# Altium schematic sheet motor_channel_x2.SchDoc
size A3; DocumentNumber: 2; SheetNumber: 2; SheetTotal: 6
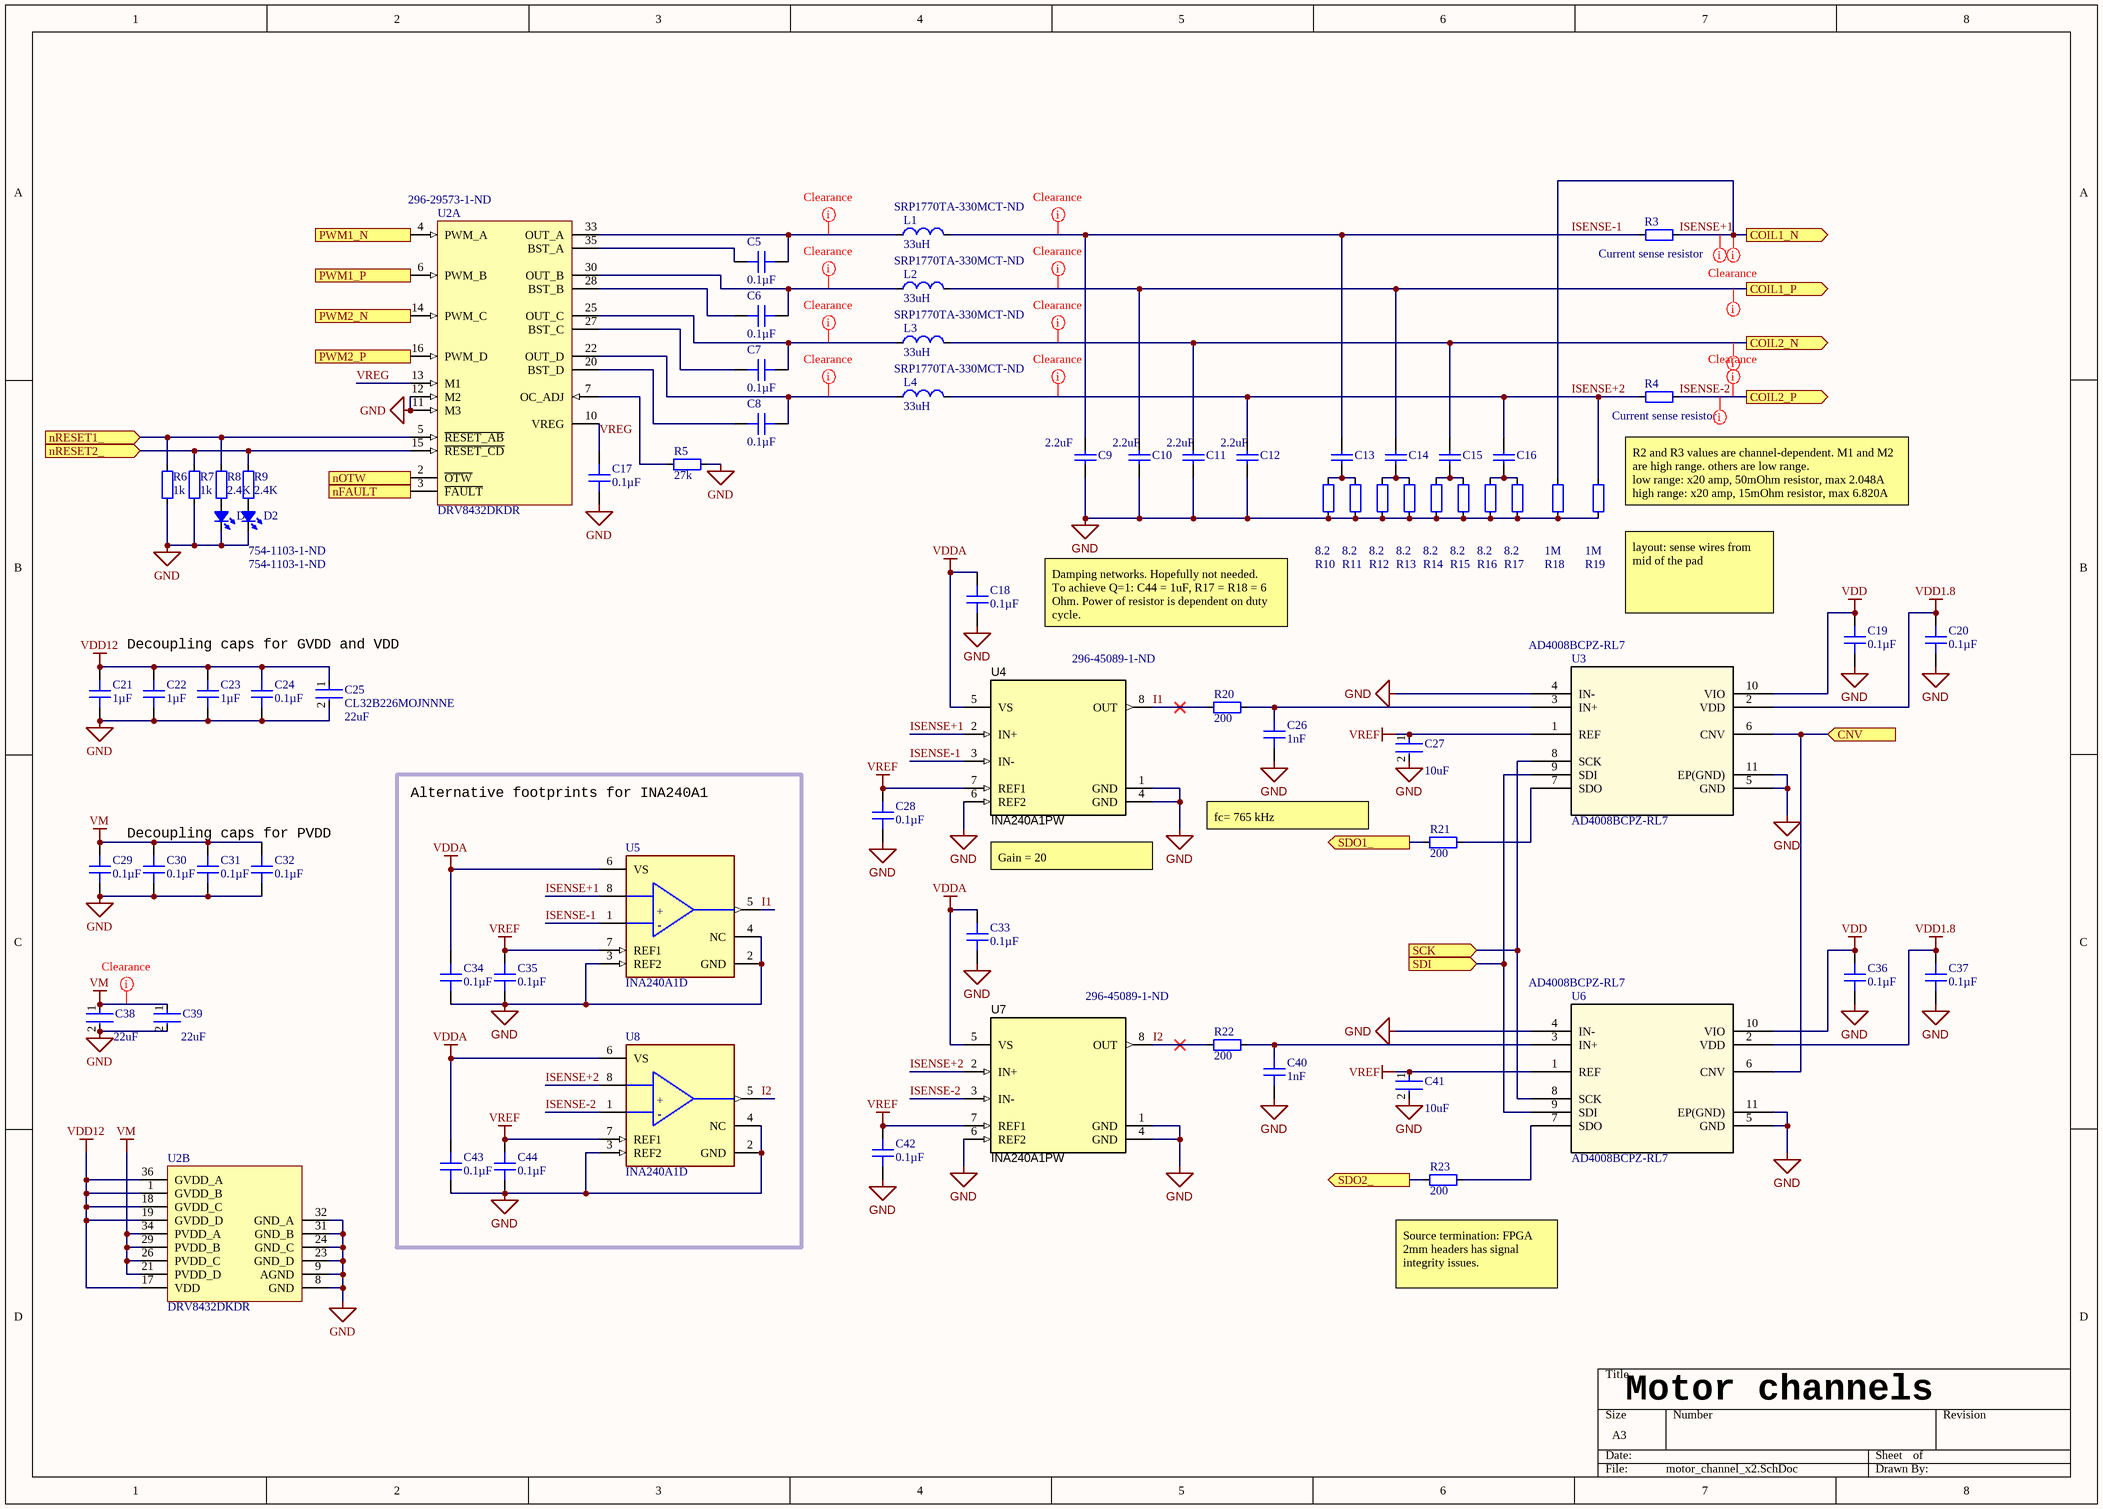
[diagram p0: motor_channel_x2.SchDoc]

## Parts
C5  0.1µF  [FP-GRM188-0_1-e0_2_0_55-IPC_B]
C6  0.1µF  [FP-GRM188-0_1-e0_2_0_55-IPC_B]
C7  0.1µF  [FP-GRM188-0_1-e0_2_0_55-IPC_B]
C8  0.1µF  [FP-GRM188-0_1-e0_2_0_55-IPC_B]
C9  Capacitance: 2.2uF  [CAPC3216X180X50NL20T25]  (hidden comment: 12061C225KAT2A)
C10  Capacitance: 2.2uF  [CAPC3216X180X50NL20T25]  (hidden comment: 12061C225KAT2A)
C11  Capacitance: 2.2uF  [CAPC3216X180X50NL20T25]  (hidden comment: 12061C225KAT2A)
C12  Capacitance: 2.2uF  [CAPC3216X180X50NL20T25]  (hidden comment: 12061C225KAT2A)
C13  12061C105KAT2A  [CAPC3216X180X50NL20T25]  (value not drawn)
C14  12061C105KAT2A  [CAPC3216X180X50NL20T25]  (value not drawn)
C15  12061C105KAT2A  [CAPC3216X180X50NL20T25]  (value not drawn)
C16  12061C105KAT2A  [CAPC3216X180X50NL20T25]  (value not drawn)
C17  0.1µF  [FP-GRM155-0_05-IPC_B]
C18  0.1µF  [FP-GRM155-0_05-IPC_B]
C19  0.1µF  [FP-GRM155-0_05-IPC_B]
C20  0.1µF  [FP-GRM155-0_05-IPC_B]
C21  1µF  [FP-GRM188-0_1-e0_2_0_55-IPC_B]
C22  1µF  [FP-GRM188-0_1-e0_2_0_55-IPC_B]
C23  1µF  [FP-GRM188-0_1-e0_2_0_55-IPC_B]
C24  0.1µF  [FP-GRM155-0_05-IPC_B]
C25  CL32B226MOJNNNE  Capacitance: 22uF  [FP-CL32-IPC_B]
C26  1nF  [FP-GRM155-0_05-IPC_B]
C27  Capacitance: 10uF  [FP-CL21-IPC_C]  (hidden comment: CL21B106KQQNNNG)
C28  0.1µF  [FP-GRM155-0_05-IPC_B]
C29  0.1µF  [FP-GRM188-0_1-e0_2_0_55-IPC_B]
C30  0.1µF  [FP-GRM188-0_1-e0_2_0_55-IPC_B]
C31  0.1µF  [FP-GRM188-0_1-e0_2_0_55-IPC_B]
C32  0.1µF  [FP-GRM188-0_1-e0_2_0_55-IPC_B]
C33  0.1µF  [FP-GRM155-0_05-IPC_B]
C34  0.1µF  [FP-GRM155-0_05-IPC_B]
C35  0.1µF  [FP-GRM155-0_05-IPC_B]
C36  0.1µF  [FP-GRM155-0_05-IPC_B]
C37  0.1µF  [FP-GRM155-0_05-IPC_B]
C38  Capacitance: 22uF  [FP-KRM55W-6_1_5_3_6_7_1_2-MFG]  (hidden comment: KRM55WR72A226MH01L)
C39  Capacitance: 22uF  [FP-KRM55W-6_1_5_3_6_7_1_2-MFG]  (hidden comment: KRM55WR72A226MH01L)
C40  1nF  [FP-GRM155-0_05-IPC_B]
C41  Capacitance: 10uF  [FP-CL21-IPC_C]  (hidden comment: CL21B106KQQNNNG)
C42  0.1µF  [FP-GRM155-0_05-IPC_B]
C43  0.1µF  [FP-GRM155-0_05-IPC_B]
C44  0.1µF  [FP-GRM155-0_05-IPC_B]
D1  Supplier Part Number 1: 754-1103-1-ND  [ROHM-SML-P11MT_V]  (hidden comment: LED_0402)
D2  Supplier Part Number 1: 754-1103-1-ND  [ROHM-SML-P11MT_V]  (hidden comment: LED_0402)
L1  value 33uH  Supplier Part Number 1: SRP1770TA-330MCT-ND  [SRP1770TA]
L2  value 33uH  Supplier Part Number 1: SRP1770TA-330MCT-ND  [SRP1770TA]
L3  value 33uH  Supplier Part Number 1: SRP1770TA-330MCT-ND  [SRP1770TA]
L4  value 33uH  Supplier Part Number 1: SRP1770TA-330MCT-ND  [SRP1770TA]
R3  Current sense resistor  [STACKPOLE CSR2512]
R4  Current sense resistor  [STACKPOLE CSR2512]
R5  value 27k  [FP-CRCW0402-e3-IPC_B]  (hidden comment: Res_0402)
R6  value 1k  [FP-CRCW0805-HPe3-IPC_B]  (hidden comment: Res_0805)
R7  value 1k  [FP-CRCW0805-HPe3-IPC_B]  (hidden comment: Res_0805)
R8  value 2.4K  [FP-CRCW0402-e3-IPC_B]  (hidden comment: Res_0402)
R9  value 2.4K  [FP-CRCW0402-e3-IPC_B]  (hidden comment: Res_0402)
R10  value 8.2  [RESC3216X70X50NL05T20]  (hidden comment: Res_0402)
R11  value 8.2  [RESC3216X70X50NL05T20]  (hidden comment: Res_0402)
R12  value 8.2  [RESC3216X70X50NL05T20]  (hidden comment: Res_0402)
R13  value 8.2  [RESC3216X70X50NL05T20]  (hidden comment: Res_0402)
R14  value 8.2  [RESC3216X70X50NL05T20]  (hidden comment: Res_0402)
R15  value 8.2  [RESC3216X70X50NL05T20]  (hidden comment: Res_0402)
R16  value 8.2  [RESC3216X70X50NL05T20]  (hidden comment: Res_0402)
R17  value 8.2  [RESC3216X70X50NL05T20]  (hidden comment: Res_0402)
R18  value 1M  [FP-CRCW0402-e3-IPC_B]  (hidden comment: Res_0402)
R19  value 1M  [FP-CRCW0402-e3-IPC_B]  (hidden comment: Res_0402)
R20  value 200  [FP-CRCW0402-e3-IPC_B]  (hidden comment: Res_0402)
R21  value 200  [FP-CRCW0402-e3-IPC_B]  (hidden comment: Res_0402)
R22  value 200  [FP-CRCW0402-e3-IPC_B]  (hidden comment: Res_0402)
R23  value 200  [FP-CRCW0402-e3-IPC_B]  (hidden comment: Res_0402)
U2  DRV8432DKDR  Supplier Part Number 1: 296-29573-1-ND  [DKD0036A_L_extra_clearance]  (parts A,B of 2)
U3  AD4008BCPZ-RL7  [CP_10_9]
U4  INA240A1PW  Supplier Part Number 1: 296-45089-1-ND  [PW0008A_N]
U5  INA240A1D  [FP-D0008A-IPC_C]
U6  AD4008BCPZ-RL7  [CP_10_9]
U7  INA240A1PW  Supplier Part Number 1: 296-45089-1-ND  [PW0008A_N]
U8  INA240A1D  [FP-D0008A-IPC_C]

## Blocks framed on the sheet
Alternative footprints for INA240A1: C34 C35 C43 C44 U5 U8

## Ports
CNV (in), COIL1_N (out), COIL1_P (out), COIL2_N (out), COIL2_P (out), nFAULT (out), nOTW (out), nRESET1_ (in), nRESET2_ (in), PWM1_N (in), PWM1_P (in), PWM2_N (in), PWM2_P (in), SCK (in), SDI (in), SDO1_ (out), SDO2_ (out)

## Nets
GND: C9.1 C10.1 C11.1 C12.1 C17.2 C18.2 C19.2 C20.2 C21.2 C22.2 C23.2 C24.2 C25.2 C26.2 C27.2 C28.2 C29.2 C30.2 C31.2 C32.2 C33.2 C34.2 C35.2 C36.2 C37.2 C38.2 C39.2 C40.2 C41.2 C42.2 C43.2 C44.2 D1.2(K) D2.2(K) R5.2 R6.1 R7.1 R10.1 R11.1 R12.1 R13.1 R14.1 R15.1 R16.1 R17.1 R18.1 R19.1 U2.8(GND) U2.9(AGND) U2.11(M3) U2.12(M2) U2.23(GND_D) U2.24(GND_C) U2.31(GND_B) U2.32(GND_A) U3.4(IN-) U3.5(GND) U3.11(EP(GND)) U4.1(GND) U4.4(GND) U4.6(REF2) U5.2(GND) U5.3(REF2) U5.4(NC) U6.4(IN-) U6.5(GND) U6.11(EP(GND)) U7.1(GND) U7.4(GND) U7.6(REF2) U8.2(GND) U8.3(REF2) U8.4(NC)
VDD: C19.1 C36.1 U3.10(VIO) U6.10(VIO)
VDD1.8: C20.1 C37.1 U3.2(VDD) U6.2(VDD)
VDD12: C21.1 C22.1 C23.1 C24.1 C25.1 U2.1(GVDD_B) U2.17(VDD) U2.18(GVDD_C) U2.19(GVDD_D) U2.36(GVDD_A)
VDDA: C18.1 C33.1 C34.1 C43.1 U4.5(VS) U5.6(VS) U7.5(VS) U8.6(VS)
VM: C29.1 C30.1 C31.1 C32.1 C38.1 C39.1 U2.21(PVDD_D) U2.26(PVDD_C) U2.29(PVDD_B) U2.34(PVDD_A)
VREF: C27.1 C28.1 C35.1 C41.1 C42.1 C44.1 U3.1(REF) U4.7(REF1) U5.7(REF1) U6.1(REF) U7.7(REF1) U8.7(REF1)
CNV: U3.6(CNV) U6.6(CNV) ; port CNV
COIL1_P: C10.2 C14.1 L2.2 ; port COIL1_P
COIL2_N: C11.2 C15.1 L3.2 ; port COIL2_N
I1: R20.1 U4.8(OUT) U5.5(OUT)
I2: R22.1 U7.8(OUT) U8.5(OUT)
ISENSE+1: R3.2 R18.2 U4.2(IN+) U5.8(IN+) ; port COIL1_N
ISENSE+2: C12.2 C16.1 L4.2 R4.1 R19.2 U7.2(IN+) U8.8(IN+)
ISENSE-1: C9.2 C13.1 L1.2 R3.1 U4.3(IN-) U5.1(IN-)
ISENSE-2: R4.2 U7.3(IN-) U8.1(IN-) ; port COIL2_P
nFAULT: U2.3(~{FAULT}) ; port nFAULT
nOTW: U2.2(~{OTW}) ; port nOTW
nRESET1_: R6.2 R8.2 U2.5(~{RESET_AB}) ; port nRESET1_
nRESET2_: R7.2 R9.2 U2.15(~{RESET_CD}) ; port nRESET2_
PWM1_N: U2.4(PWM_A) ; port PWM1_N
PWM1_P: U2.6(PWM_B) ; port PWM1_P
PWM2_N: U2.14(PWM_C) ; port PWM2_N
PWM2_P: U2.16(PWM_D) ; port PWM2_P
SCK: U3.8(SCK) U6.8(SCK) ; port SCK
SDI: U3.9(SDI) U6.9(SDI) ; port SDI
SDO1_: R21.1 ; port SDO1_
SDO2_: R23.1 ; port SDO2_
VREG: C17.1 U2.10(VREG) U2.13(M1)
NetC5_1: C5.1 U2.35(BST_A)
NetC5_2: C5.2 L1.1 U2.33(OUT_A)
NetC6_1: C6.1 U2.28(BST_B)
NetC6_2: C6.2 L2.1 U2.30(OUT_B)
NetC7_1: C7.1 U2.27(BST_C)
NetC7_2: C7.2 L3.1 U2.25(OUT_C)
NetC8_1: C8.1 U2.20(BST_D)
NetC8_2: C8.2 L4.1 U2.22(OUT_D)
NetC13_2: C13.2 R10.2 R11.2
NetC14_2: C14.2 R12.2 R13.2
NetC15_2: C15.2 R14.2 R15.2
NetC16_2: C16.2 R16.2 R17.2
NetC26_1: C26.1 R20.2 U3.3(IN+)
NetC40_1: C40.1 R22.2 U6.3(IN+)
NetD1_1: D1.1(A) R8.1
NetD2_1: D2.1(A) R9.1
NetR5_1: R5.1 U2.7(OC_ADJ)
NetR21_2: R21.2 U3.7(SDO)
NetR23_2: R23.2 U6.7(SDO)

## Layout directives
net class hv: COIL1_P, COIL2_N, ISENSE+1, ISENSE+2, ISENSE-1, ISENSE-2, NetC5_2, NetC6_2, NetC7_2, NetC8_2, VM
net class no-copy-routing: COIL1_P, COIL2_N, ISENSE+1, ISENSE-2

## Notes on the sheet
- R2 and R3 values are channel-dependent. M1 and M2 are high range. others are low range.
  low range: x20 amp, 50mOhm resistor, max 2.048A
  high range: x20 amp, 15mOhm resistor, max 6.820A
- Decoupling caps for GVDD and VDD
- Damping networks. Hopefully not needed.
  To achieve Q=1: C44 = 1uF, R17 = R18 = 6 Ohm. Power of resistor is dependent on duty cycle.
- (near R19) layout: sense wires from mid of the pad
- Decoupling caps for PVDD
- fc= 765 kHz
- Gain = 20
- (near R23) Source termination: FPGA 2mm headers has signal integrity issues.
- Motor channels
- (in symbol CMP-04895-000409-1) +; -

## Library data of the parts
C5-C8 C29-C32 = 06031C104KAT2A: CAP CER 0.1UF 100V X7R 0603; Manufacturer: AVX Corporation; Tolerance: ±10%; Part Number: 06031C104KAT2A; Value: 0.1µF; Applications: General Purpose; Capacitance: 0.1µF; ComponentLink1Description: Datasheet; ComponentLink1URL: http://datasheets.avx.com/X7RDielectric.pdf; ComponentLink2Description: DigiKey Link; ComponentLink2URL: http://digikey.com/product-detail/en/avx-corporation/06031C104KAT2A/478-10047-1-ND/6564270; Device Package: 0603 (1608 Metric); LastUpdated: 9/2/2020 1:03:14 AM; Lifecycle Status: Active; Minimum Order: 1; Mounting Type: Surface Mount, MLCC; Operating Temperature: -55°C ~ 125°C; Package / Case: 0603 (1608 Metric); Packaging: TapeAndReel; PartId: 14077; Part Status: Active; Price: 0.03; Series: -; Size / Dimension: 0.063" L x 0.032" W (1.60mm x 0.81mm); Supplier 1: DigiKey; Supplier Part Number 1: 478-10047-1-ND; Temperature Coefficient: X7R; Thickness (Max): 0.037" (0.94mm); Voltage - Rated: 100V
C9-C12 = CMP-2000-07542-1: Chip Capacitor, 2.2 uF, +/- 10%, 100 V, -55 to 125 degC, 1206 (3216 Metric), RoHS, Tape and Reel; Manufacturer: AVX; Case\/Package: 1206; Voltage: 100V; Dielectric: X7R; Thickness: 0.037inch; Case Code (Metric): 3216; Mounting Technology: SurfaceMount; Tolerance: 10%; Package Quantity: 2500; Mount: SurfaceMount; REACH SVHC: NoSVHC; Case Code (Imperial): 1206; Datasheet URL: http://datasheets.avx.com/X7RDielectric.pdf; Voltage Rating: 100V; Package Reference: 1206; Termination: SMD/SMT; Max Operating Temperature: 125degC; Depth: 1.6mm; Voltage Rating (DC): 100V; Width: 0.063inch; Min Operating Temperature: -55degC; RoHSCompliant: true; Packaging: TapeandReel; Package Description: 2-Pin Surface Mount Device, Body 3.2 x 1.6 mm; Datasheet Version: 03/2017; Manufacturer URL: http://www.avx.com/; Lead Free: LeadFree; Length: 3.2mm
C13-C16 = CMP-1037-04728-2: Chip Capacitor, 1 uF, +/- 10%, 100 V, -55 to 125 degC, 1206 (3216 Metric), RoHS, Tape and Reel; Manufacturer: AVX; Capacitance: 1µF; Dielectric: X7R; Rated Voltage: 100V; Mounting Technology: SurfaceMount; Package Description: 2-Pin Surface Mount Device, Body 3.2 x 1.6 mm; Case Size/Dimension: 1206; Datasheet Version: 07/2016; Manufacturer URL: http://www.avx.com/; Package Reference: 1206; Datasheet URL: http://datasheets.avx.com/X7RDielectric.pdf; Tolerance (%): ±10%
C17-C20 C24 C28 C33-C37 C42-C44 = 04023C104KAT2A: CAP CER 0.1UF 25V X7R 0402; Manufacturer: AVX Corporation; Tolerance: ±10%; Value: 0.1µF; Part Number: 04023C104KAT2A; Applications: General Purpose; Capacitance: 0.1µF; ComponentLink1Description: Datasheet; ComponentLink1URL: http://datasheets.avx.com/X7RDielectric.pdf; ComponentLink2Description: DigiKey Link; ComponentLink2URL: http://digikey.com/product-detail/en/avx-corporation/04023C104KAT2A/478-7868-1-ND/3881491; Device Package: 0402 (1005 Metric); LastUpdated: 9/2/2020 1:02:21 AM; Lifecycle Status: Active; Minimum Order: 1; Mounting Type: Surface Mount, MLCC; Operating Temperature: -55°C ~ 125°C; Package / Case: 0402 (1005 Metric); Packaging: CutTape; PartId: 3190; Part Status: Active; Price: 0.13; Series: -; Size / Dimension: 0.039" L x 0.020" W (1.00mm x 0.50mm); Supplier 1: DigiKey; Supplier Part Number 1: 478-7868-1-ND; Temperature Coefficient: X7R; Thickness (Max): 0.022" (0.55mm); Voltage - Rated: 25V
C21-C23 = TMK107B7105KA-T: CAP CER 1UF 25V X7R 0603; Manufacturer: Taiyo Yuden; Tolerance: ±10%; Part Number: TMK107B7105KA-T; Value: 1µF; Applications: General Purpose; Capacitance: 1µF; ComponentLink1Description: Datasheet; ComponentLink1URL: https://www.yuden.co.jp/productdata/catalog/mlcc01_e.pdf; ComponentLink2Description: DigiKey Link; ComponentLink2URL: http://digikey.com/product-detail/en/taiyo-yuden/TMK107B7105KA-T/587-2984-1-ND/2714177; Device Package: 0603 (1608 Metric); LastUpdated: 9/2/2020 1:03:30 AM; Lifecycle Status: Active; Minimum Order: 1; Mounting Type: Surface Mount, MLCC; Operating Temperature: -55°C ~ 125°C; Package / Case: 0603 (1608 Metric); Packaging: TapeAndReel; PartId: 5586; Part Status: Active; Price: 0.01; Series: M; Size / Dimension: 0.063" L x 0.031" W (1.60mm x 0.80mm); Supplier 1: DigiKey; Supplier Part Number 1: 587-2984-1-ND; Temperature Coefficient: X7R; Thickness (Max): 0.035" (0.90mm); Voltage - Rated: 25V
C25 = CMP-13271-003818-1: Cap Ceramic 22uF 16V X7R ±20% SMD 1210 +125°C Embossed T/R; Mount: Surface Mount; Case/Package: 1210; Case Code (Imperial): 1210; Depth: 2.5mm; Packaging: Tape and Reel; Case Code (Metric): 3225; Package Quantity: 1; Min Operating Temperature: -55°C; Dielectric: X7R; Height: 2.5mm; Length: 3.2mm; Max Operating Temperature: 125°C; Thickness: 0.106inch; Width: 0.098inch; Tolerance: 20%; Voltage Rating: 16V; Radiation Hardening: No
C26 C40 = 04023C102KAT2A: CAP CER 1000PF 25V X7R 0402; Manufacturer: AVX Corporation; Tolerance: ±10%; Value: 1nF; ComponentLink1Description: Datasheet; ComponentLink1URL: http://datasheets.avx.com/X7RDielectric.pdf; Part Number: 04023C102KAT2A; Applications: General Purpose; Capacitance: 1000pF; ComponentLink2Description: DigiKey Link; ComponentLink2URL: http://digikey.com/product-detail/en/avx-corporation/04023C102KAT2A/478-6193-1-ND/2391392; Device Package: 0402 (1005 Metric); LastUpdated: 2020-09-02 01:02:20.597000; Lifecycle Status: Active; Minimum Order: 1; Mounting Type: Surface Mount, MLCC; Operating Temperature: -55°C ~ 125°C; Package / Case: 0402 (1005 Metric); Packaging: TapeAndReel; PartId: 3384; Part Status: Active; Price: 0.01; Series: -; Size / Dimension: 0.039 L x 0.020 W (1.00mm x 0.50mm); Temperature Coefficient: X7R; Thickness (Max): 0.022 (0.56mm); Voltage - Rated: 25V; Supplier 1: DigiKey; Supplier Part Number 1: 478-6193-1-ND
C27 C41 = CMP-13271-001427-1: CL21 Series 0805 10uF 6.3V ±10% Tolerance X7R Multilayer Ceramic Chip Capacitor; Min Operating Temperature: -55°C; Dielectric: X7R; Voltage Rating: 6.3V; Case/Package: 0805; Height: 1.25mm; Case Code (Metric): 2012; Tolerance: 10%; Packaging: Tape and Reel; Thickness: 0.055inch; Voltage: 6.3V; Max Operating Temperature: 125°C; Lead Free: Lead Free; Package Quantity: 3000; Case Code (Imperial): 0805; Depth: 1.25mm; Width: 0.049inch; Length: 2mm; Mount: Surface Mount
C38 C39 = CMP-06035-003571-1: CAP CER 22UF 100V X7R SMD; Tolerance: 20%; Lead/Base Style: J-Lead; Packaging: Cut Tape; Mount: Surface Mount; Min Operating Temperature: -55°C; Max Operating Temperature: 125°C; Case/Package: SMD/SMT; Voltage Rating: 100V; Supplier 1: Arrow Electronics; Supplier Part Number 1: KRM55WR72A226MH01L
D1 D2 = LED_0402: LED ORANGE CLEAR CHIP SMD; Manufacturer: Kingbright; Manufacturer Part Number: APHHS1005SECK; Viewing Angle: 120°; Lens Style: Clear,Flat; Luminous Intensity: 240mcd; Forward Voltage: 2.1V; Forward Current: 20mA; Dominant Wavelength: 601nm; Number of LEDs: 1; Supplier 1: Digi-Key; RoHS: Yes; Category: LEDs; Stock 1: 25673; Pricing 1: 1=0.49000, 10=0.32500, 100=0.21700, 500=0.15010, 1000=0.12508 (USD); Mount: Surface Mount; Case/Package: 0402; Number of Pins: 2; Color: Orange; Case Code (Metric): 1005; Case Code (Imperial): 0402; Lens Color: Clear; Min Operating Temperature: -40°C; Max Operating Temperature: 85°C; Package Quantity: 2000; Packaging: Tape and Reel; Illumination Color: Orange; Test Current: 20mA; Wavelength: 601nm; Series: APHHS; Length: 1mm; Width: 0.5mm; Height: 0.6mm; Lead Free: Lead Free; RoHS Compliant: Yes; ComponentLink1URL: https://datasheet.ciiva.com/2114/aphhs1005seck-2114149.pdf?src-supplier=Digi-Key; ComponentLink1Description: https://datasheet.ciiva.com/2114/aphhs1005seck-2114149.pdf?src-supplier=Digi-Key; ComponentLink2URL: https://datasheet.ciiva.com/4688/aphhs1005seck-36485-4688716.pdf?src-supplier=Mouser; ComponentLink2Description: https://datasheet.ciiva.com/4688/aphhs1005seck-36485-4688716.pdf?src-supplier=Mouser; ComponentLink3URL: https://datasheet.ciiva.com/2114/aphhs1005seck-2114150.pdf?src-supplier=Digi-Key; ComponentLink3Description: https://datasheet.ciiva.com/2114/aphhs1005seck-2114150.pdf?src-supplier=Digi-Key; ComponentLink4URL: https://datasheet.ciiva.com/16412/aphhs1005seck-16412186.pdf?src-supplier=Future+Electronics; ComponentLink4Description: https://datasheet.ciiva.com/16412/aphhs1005seck-16412186.pdf?src-supplier=Future+Electronics; ComponentLink5URL: https://datasheet.ciiva.com/2114/aphhs1005seck-2114151.pdf?src-supplier=Digi-Key; ComponentLink5Description: https://datasheet.ciiva.com/2114/aphhs1005seck-2114151.pdf?src-supplier=Digi-Key
L1-L4 = Ind_0805: Inductor Power Shielded Wirewound 33uH 20% 100KHz 20Q-Factor Carbonyl Powder 10.7A 0.044Ohm DCR Automotive T/R; Manufacturer: TDK; Manufacturer Part Number: MPZ2012S300AT000; Core Material: Ferrite; Impedance: 30R; Current Rating: 6A; DC Resistance (DCR): 10mR; Inductance: 100uH; Saturation Current: 6.5A; Self Resonant Frequency: 2MHz; RMS Current (Irms): 5.3A; Stock 1: 117704; Pricing 1: 1=0.11, 10=0.091, 25=0.0704, 50=0.0584, 100=0.0503, 250=0.04028, 500=0.03624, 1000=0.0302 (USD); Mount: Surface Mount; Case/Package: 0805; Number of Pins: 3; Case Code (Metric): 2012; Case Code (Imperial): 0805; Packaging: Tape and Reel; Package Quantity: 1; Max DC Current: 6A; Length: 0.079inch; Height: 0.041inch; Width: 0.049inch; Depth: 1.25mm; REACH SVHC: No SVHC; Lead Free: Lead Free; ComponentLink1URL: https://datasheet.ciiva.com/46381/1750041-46381644.pdf; ComponentLink1Description: https://datasheet.ciiva.com/46381/1750041-46381644.pdf; ComponentLink2URL: https://datasheet.ciiva.com/48682/beads-commercial-power-mpz-en-48682508.pdf; ComponentLink2Description: https://datasheet.ciiva.com/48682/beads-commercial-power-mpz-en-48682508.pdf; ComponentLink3URL: https://datasheet.ciiva.com/8077/55169-8077085.pdf; ComponentLink3Description: https://datasheet.ciiva.com/8077/55169-8077085.pdf; ComponentLink4URL: https://datasheet.ciiva.com/8077/55169-8077086.pdf; ComponentLink4Description: https://datasheet.ciiva.com/8077/55169-8077086.pdf; ComponentLink5URL: https://datasheet.ciiva.com/46634/beads-commercial-power-mpz-en-46634590.pdf; ComponentLink5Description: https://datasheet.ciiva.com/46634/beads-commercial-power-mpz-en-46634590.pdf; ComponentLink6URL: https://datasheet.ciiva.com/46634/beads-commercial-power-mpz-en-46634367.pdf; ComponentLink6Description: https://datasheet.ciiva.com/46634/beads-commercial-power-mpz-en-46634367.pdf; RoHS: Yes; Category: Fixed Inductors; Stock 2: 10; Pricing 2: 1=4.75000, 10=4.35200, 25=3.95640, 50=3.32340, 100=2.84860 (USD); Min Operating Temperature: -40°C; Max Operating Temperature: 150°C; Resistor Type: Wirewound; Shielding: Shielded; Test Frequency: 100kHz; Tolerance: 20%; Inductance Tolerance: 20%; Height - Seated (Max): 0.276inch; Ratings: AEC-Q200; RoHS Compliant: Yes; ComponentLink7URL: http://www.farnell.com/datasheets/2360566.pdf?src-supplier=Farnell; ComponentLink7Description: http://www.farnell.com/datasheets/2360566.pdf?src-supplier=Farnell; ComponentLink8URL: http://www.farnell.com/datasheets/1955470.pdf?src-supplier=Element14; ComponentLink8Description: http://www.farnell.com/datasheets/1955470.pdf?src-supplier=Element14; ComponentLink9URL: http://www.bourns.com/docs/Product-Datasheets/SRP1770TA.pdf?src-supplier=Digi-Key; ComponentLink9Description: http://www.bourns.com/docs/Product-Datasheets/SRP1770TA.pdf?src-supplier=Digi-Key; ComponentLink10URL: https://www.bourns.com/docs/Product-Datasheets/SRP1770TA.pdf?src-supplier=Digi-Key; ComponentLink10Description: https://www.bourns.com/docs/Product-Datasheets/SRP1770TA.pdf?src-supplier=Digi-Key; ComponentLink11URL: http://www.farnell.com/datasheets/1955470.pdf?src-supplier=Farnell; ComponentLink11Description: http://www.farnell.com/datasheets/1955470.pdf?src-supplier=Farnell; Supplier 1: Digi-Key
R3 R4 = Res_0402_3: RES 2512
R5 R8-R23 = Res_0402: Resistor
R6 R7 = Res_0805: Resistor
U2 = CMP-1556-00009-2: 12 A Dual Brushed DC or Single Bipolar Stepper Motor Driver (PWM Ctrl), 0 to 52.5 V, -40 to 85 degC, 36-pin SOP (DKD36), Green (RoHS & no Sb/Br); Manufacturer: Texas Instruments; Vs(Min)(V): 0; rDS (ON) (LS + HS)(mOhms): 220; RMS Output Current(A): 7; Vs(Max)(V): 52.5; Peak Output Current(A): 12; Operating Supply Voltage: 50V; Output Current: 7A; Max Supply Voltage: 52.5V; Min Supply Voltage: 0V; Number of Outputs: 2; Nominal Supply Current: 10.5mA; Power Dissipation: 5W; Max Output Current: 12A; Fault Protection: Over Temperature,Short Circuit; DatasheetVersion: SLES242D; ComponentLink1URL: http://www.ti.com/; ComponentLink1Description: Manufacturer URL; PackageVersion: 4204421-2/K, 11/2013; ComponentLink3Description: Package Specification; Package Reference: DKD0036A; ComponentLink2Description: Datasheet; PackageDescription: 36-Pin Plastic Small Outline, Body 15.9 x 11 mm, Pitch 0.65 mm; Control I/F: PWM; Eco-Plan: Green (RoHS & no Sb/Br); Mounting Technology: Surface Mount; ComponentLink2URL: http://www.ti.com/general/docs/lit/getliterature.tsp?genericPartNumber=DRV8432&fileType=pdf; PartNumber: DRV8432DKDR; ComponentLink3URL: http://www.ti.com/lit/ml/mpds126j/mpds126j.pdf; Supplier 1: Digi-Key; Manufacturer Part Number: DRV8432DKDR; RoHS: Yes; Category: Amplifiers - Audio; Stock 1: 927; Pricing 1: 1=12.21000, 10=11.03000, 25=10.51720, 100=8.72170, 250=7.95212 (USD); Mount: Surface Mount; Case/Package: HSSOP; Number of Pins: 36; Min Operating Temperature: -40°C; Max Operating Temperature: 85°C; Package Quantity: 500; Packaging: Tape and Reel; Supply Current: 10.5mA; Series: DRV8432; Interface: PWM; Output Current per Channel: 7A; Radiation Hardening: No; Lead Free: Lead Free; RoHS Compliant: Yes; ComponentLink4URL: https://datasheet.ciiva.com/15109/getdatasheetpartid-482142-15109561.pdf?src-supplier=Verical; ComponentLink4Description: https://datasheet.ciiva.com/15109/getdatasheetpartid-482142-15109561.pdf?src-supplier=Verical; ComponentLink5URL: https://datasheet.ciiva.com/1959/drv8432-1959978.pdf?src-supplier=Digi-Key; ComponentLink5Description: https://datasheet.ciiva.com/1959/drv8432-1959978.pdf?src-supplier=Digi-Key; ComponentLink6URL: https://datasheet.ciiva.com/41457/001013555-da-01-en-ic-bridge-driver-drv8432dkdr-ssop-36-tid-41457289.pdf?src-supplier=Conrad; ComponentLink6Description: https://datasheet.ciiva.com/41457/001013555-da-01-en-ic-bridge-driver-drv8432dkdr-ssop-36-tid-41457289.pdf?src-supplier=Conrad; ComponentLink7URL: https://datasheet.ciiva.com/3228/drv8432-3228999.pdf?src-supplier=Avnet; ComponentLink7Description: https://datasheet.ciiva.com/3228/drv8432-3228999.pdf?src-supplier=Avnet; ComponentLink8URL: https://datasheet.ciiva.com/1959/drv8432-1959979.pdf?src-supplier=Digi-Key; ComponentLink8Description: https://datasheet.ciiva.com/1959/drv8432-1959979.pdf?src-supplier=Digi-Key; ComponentLink9URL: https://datasheet.ciiva.com/1959/drv8432-1959980.pdf?src-supplier=Digi-Key; ComponentLink9Description: https://datasheet.ciiva.com/1959/drv8432-1959980.pdf?src-supplier=Digi-Key
U3 U6 = AD4008BCPZ-RL7: 16-Bit, 2 MSPS/1 MSPS/500 kSPS, / Precision, Pseudo Differential, SAR ADCs; Value: Value; Type: Type; RefDes: RefDes; Supplier 1: Arrow Electronics; Supplier Part Number 1: AD4008BCPZ-RL7
U4 U7 = INA240A1PW: TEXAS INSTRUMENTS - INA240A1PWR . - CURRENT SENSE AMPLIFIER, 400KHZ, TSSOP-8; SymbolCreator: Altium; CompType: IC; U/M: EA; Number of Circuits: 1; Slew Rate: 2V/µs; Input Bias Current: 90uA; Input Offset Voltage (Vos): 5uV; Operating Supply Current: 1.8mA; SymbolVersion: 2016-01-07; PartNumber: INA240A1PW; PackageReference: PW0008A; MountType: SMT; ComponentLink1Description: Datasheet Link; ComponentLink1URL: https://sps06.itg.ti.com/sites/KMS/crossdivteams/altium/docs/ComponentDatasheets/INA240 Prelim DS - 9-15-15.pdf; Publisher: Texas Instruments; LatestRevisionDate: 2016-03-14; Manufacturer: Texas Instruments; Alternate Manufacturer: Texas Instruments; Manufacturer Part Number: INA240A1PWR; Category: Amplifiers - Op Amps, Buffer, Instrumentation; Stock 1: 14825; Pricing 1: 1=2.78000, 10=2.50000, 50=2.37000, 100=1.95000, 1000=1.40000, 10000=1.34000 (USD); Mount: Surface Mount; Case/Package: TSSOP; Min Operating Temperature: -40°C; Max Operating Temperature: 125°C; Packaging: Tape and Reel; -3db Bandwidth: 400kHz; RoHS Compliant: Yes; Lead Free: Lead Free; ComponentLink2URL: http://www.ti.com/lit/ds/symlink/ina240.pdf?src-supplier=Farnell; ComponentLink2Description: http://www.ti.com/lit/ds/symlink/ina240.pdf?src-supplier=Farnell; ComponentLink3URL: http://www.ti.com/lit/ds/symlink/ina240.pdf?src-supplier=Digi-Key; ComponentLink3Description: http://www.ti.com/lit/ds/symlink/ina240.pdf?src-supplier=Digi-Key; ComponentLink4URL: http://www.ti.com/lit/ds/symlink/ina240.pdf?src-supplier=Newark; ComponentLink4Description: http://www.ti.com/lit/ds/symlink/ina240.pdf?src-supplier=Newark; Supplier 1: Digi-Key; Supplier 2: Mouser; Supplier Part Number 2: 595-INA240A1PWR
U5 U8 = CMP-04895-000409-1: IC CURR SENSE 1 CIRCUIT 8SOIC; Input Offset Voltage (Vos): 5uV; Number of Circuits: 1; Slew Rate: 2V/µs; Input Bias Current: 90uA; -3db Bandwidth: 400kHz; Operating Supply Current: 1.8mA; Packaging: Rail/Tube; Min Operating Temperature: -40°C; Max Operating Temperature: 125°C; RoHS Compliant: Yes; Case/Package: SOIC; Mount: Surface Mount